# Altium schematic sheet MCU.SchDoc
size A1; Revision: C.2(PCB.SCH)
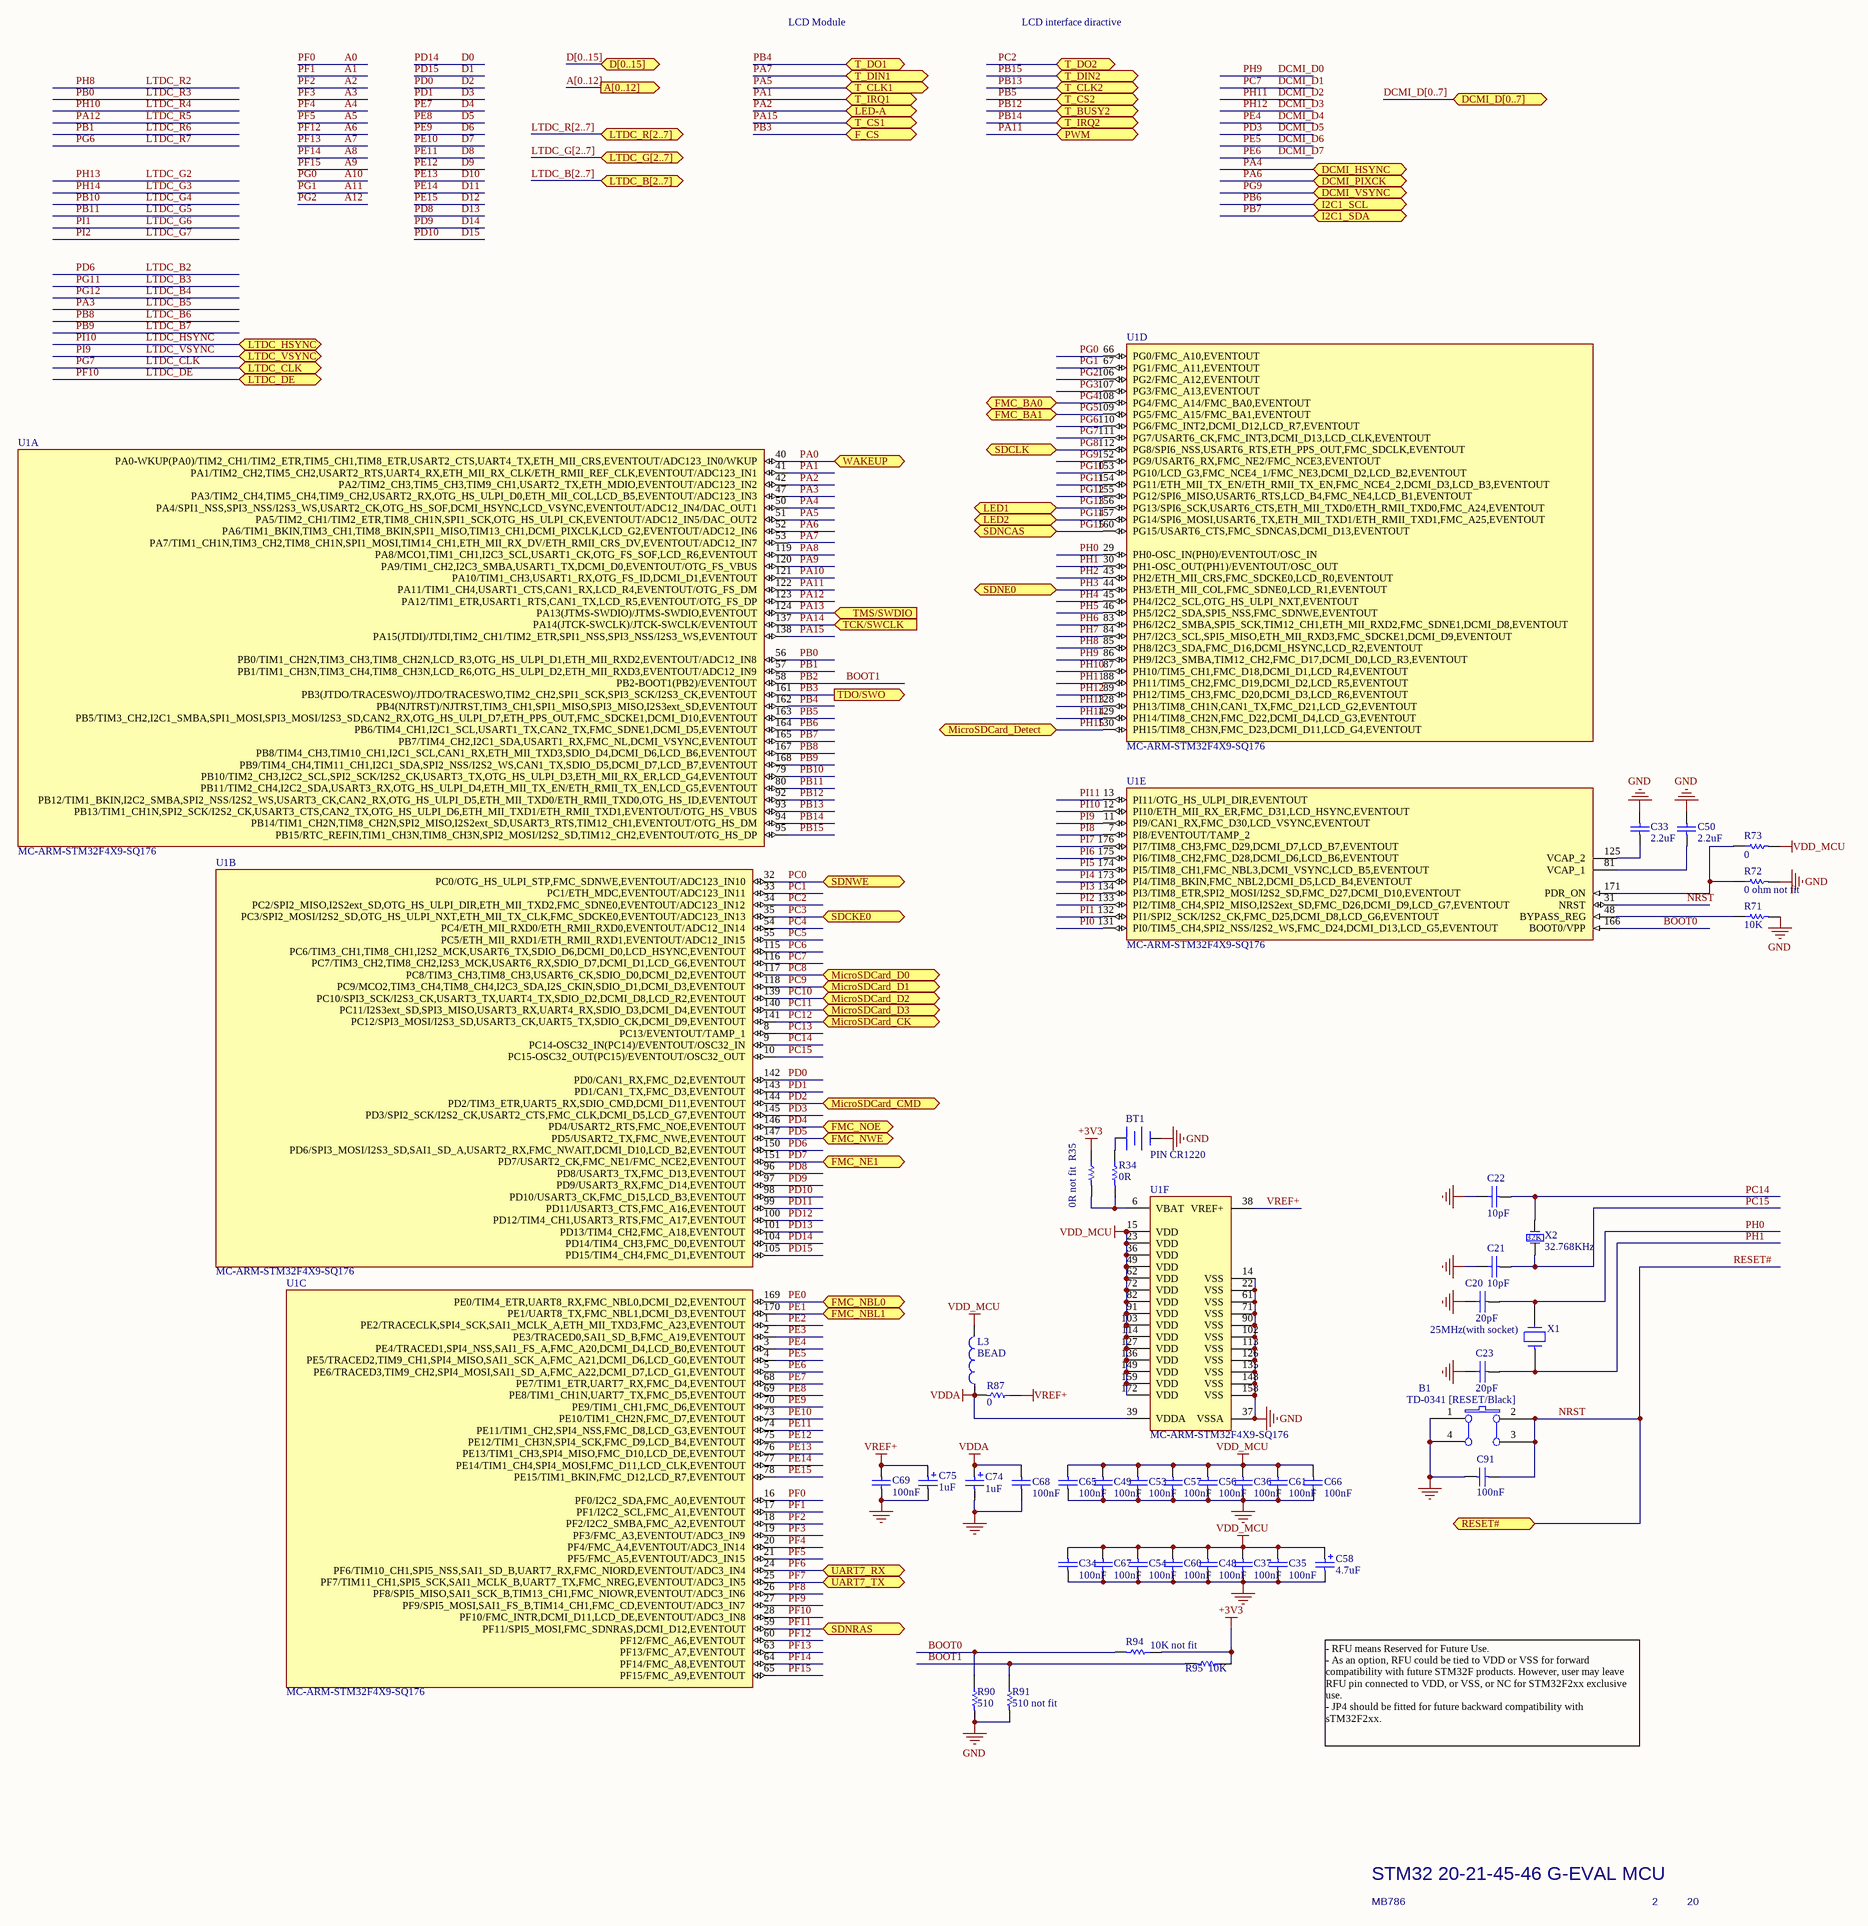
[diagram p0: MCU.SchDoc]

## Parts
B1  TD-0341 [RESET/Black]  [PB]
BT1  PIN CR1220  [PCBComponent_1]
C20  20pF  [0603_C]
C21  10pF  [0603_C]
C22  10pF  [0603_C]
C23  20pF  [0603_C]
C33  2.2uF  [CAPC3216X100N]
C34  100nF  [0603_C]
C35  100nF  [0603_C]
C36  100nF  [0603_C]
C37  100nF  [0603_C]
C48  100nF  [0603_C]
C49  100nF  [0603_C]
C50  2.2uF  [CAPC3216X100N]
C53  100nF  [0603_C]
C54  100nF  [0603_C]
C56  100nF  [0603_C]
C57  100nF  [0603_C]
C58  4.7uF  [AVX-CAPC3528_V]
C60  100nF  [0603_C]
C61  100nF  [0603_C]
C65  100nF  [0603_C]
C66  100nF  [0603_C]
C67  100nF  [0603_C]
C68  100nF  [0603_C]
C69  100nF  [0603_C]
C74  1uF  [AVX-CAPC3528_V]
C75  1uF  [AVX-CAPC3528_V]
C91  100nF  [0603_C]
L3  BEAD  [INDC2012X105N]
R34  0R  [0603_R]
R35  0R not fit  [0603_R]
R71  10K  [0603_R]
R72  0 ohm not fit  [0603_R]
R73  0  [0603_R]
R87  0  [0603_R]
R90  510  [0603_R]
R91  510 not fit  [0603_R]
R94  10K not fit  [0603_R]
R95  10K  [0603_R]
U1  MC-ARM-STM32F4X9-SQ176  [STM-LQFP176_N]  (parts A,B,C,D,E,F of 6)
X1  25MHz(with socket)  [HC49/US-SMD]
X2  32.768KHz  [Cylindrical crystal]

## Ports
A[0..12] (out), D[0..15] (bidir), DCMI_D[0..7], DCMI_HSYNC, DCMI_PIXCK, DCMI_VSYNC, F_CS, FMC_BA0, FMC_BA1, FMC_NBL0, FMC_NBL1, FMC_NE1, FMC_NOE, FMC_NWE, I2C1_SCL, I2C1_SDA, LED1, LED2, LED-A, LTDC_B[2..7] (bidir), LTDC_CLK, LTDC_DE, LTDC_G[2..7] (bidir), LTDC_HSYNC, LTDC_R[2..7] (bidir), LTDC_VSYNC, MicroSDCard_CK (bidir), MicroSDCard_CMD (bidir), MicroSDCard_D0 (bidir), MicroSDCard_D1 (bidir), MicroSDCard_D2 (bidir), MicroSDCard_D3 (bidir), MicroSDCard_Detect, PWM, RESET# (bidir), SDCKE0, SDCLK, SDNCAS, SDNE0, SDNRAS, SDNWE, T_BUSY2, T_CLK1, T_CLK2, T_CS1, T_CS2, T_DIN1, T_DIN2, T_DO1, T_DO2, T_IRQ1, T_IRQ2, TCK/SWCLK (in), TDO/SWO (out), TMS/SWDIO (in), UART7_RX, UART7_TX, WAKEUP

## Nets
+3V3: R35.1 R94.1 R95.1
GND: B1.1(A0) B1.4(A1) BT1.2(-) C20.2 C21.2 C22.2 C23.2 C33.2 C34.2 C35.2 C36.2 C37.2 C48.2 C49.2 C50.2 C53.2 C54.2 C56.2 C57.2 C58.2 C60.2 C61.2 C65.2 C66.2 C67.2 C68.2 C69.2 C74.2 C75.2 C91.1 R71.2 R72.2 R90.2 R91.2 U1.14(VSS) U1.22(VSS) U1.37(VSSA) U1.61(VSS) U1.71(VSS) U1.90(VSS) U1.102(VSS) U1.113(VSS) U1.126(VSS) U1.135(VSS) U1.148(VSS) U1.158(VSS) X2.0
VDD_MCU: C34.1 C35.1 C36.1 C37.1 C48.1 C49.1 C53.1 C54.1 C56.1 C57.1 C58.1 C60.1 C61.1 C65.1 C66.1 C67.1 L3.2 R73.2 U1.15(VDD) U1.23(VDD) U1.36(VDD) U1.49(VDD) U1.62(VDD) U1.72(VDD) U1.82(VDD) U1.91(VDD) U1.103(VDD) U1.114(VDD) U1.127(VDD) U1.136(VDD) U1.149(VDD) U1.159(VDD) U1.172(VDD)
VDDA: C68.1 C74.1 L3.1 R87.2 U1.39(VDDA)
VREF+: C69.1 C75.1 R87.1 U1.38(VREF+)
A0: U1.16(PF0/I2C2_SDA,FMC_A0,EVENTOUT)  [also labelled PF0]
A1: U1.17(PF1/I2C2_SCL,FMC_A1,EVENTOUT)  [also labelled PF1]
A2: U1.18(PF2/I2C2_SMBA,FMC_A2,EVENTOUT)  [also labelled PF2]
A3: U1.19(PF3/FMC_A3,EVENTOUT/ADC3_IN9)  [also labelled PF3]
A4: U1.20(PF4/FMC_A4,EVENTOUT/ADC3_IN14)  [also labelled PF4]
A5: U1.21(PF5/FMC_A5,EVENTOUT/ADC3_IN15)  [also labelled PF5]
A6: U1.60(PF12/FMC_A6,EVENTOUT)  [also labelled PF12]
A7: U1.63(PF13/FMC_A7,EVENTOUT)  [also labelled PF13]
A8: U1.64(PF14/FMC_A8,EVENTOUT)  [also labelled PF14]
A9: U1.65(PF15/FMC_A9,EVENTOUT)  [also labelled PF15]
A10: U1.66(PG0/FMC_A10,EVENTOUT)  [also labelled PG0]
A11: U1.67(PG1/FMC_A11,EVENTOUT)  [also labelled PG1]
A12: U1.106(PG2/FMC_A12,EVENTOUT)  [also labelled PG2]
BOOT0: R90.1 R94.2 U1.166(BOOT0/VPP)
BOOT1: R91.1 R95.2 U1.58(PB2-BOOT1(PB2)/EVENTOUT)  [also labelled PB2]
D0: U1.104(PD14/TIM4_CH3,FMC_D0,EVENTOUT)  [also labelled PD14]
D1: U1.105(PD15/TIM4_CH4,FMC_D1,EVENTOUT)  [also labelled PD15]
D2: U1.142(PD0/CAN1_RX,FMC_D2,EVENTOUT)  [also labelled PD0]
D3: U1.143(PD1/CAN1_TX,FMC_D3,EVENTOUT)  [also labelled PD1]
D4: U1.68(PE7/TIM1_ETR,UART7_RX,FMC_D4,EVENTOUT)  [also labelled PE7]
D5: U1.69(PE8/TIM1_CH1N,UART7_TX,FMC_D5,EVENTOUT)  [also labelled PE8]
D6: U1.70(PE9/TIM1_CH1,FMC_D6,EVENTOUT)  [also labelled PE9]
D7: U1.73(PE10/TIM1_CH2N,FMC_D7,EVENTOUT)  [also labelled PE10]
D8: U1.74(PE11/TIM1_CH2,SPI4_NSS,FMC_D8,LCD_G3,EVENTOUT)  [also labelled PE11]
D9: U1.75(PE12/TIM1_CH3N,SPI4_SCK,FMC_D9,LCD_B4,EVENTOUT)  [also labelled PE12]
D10: U1.76(PE13/TIM1_CH3,SPI4_MISO,FMC_D10,LCD_DE,EVENTOUT)  [also labelled PE13]
D11: U1.77(PE14/TIM1_CH4,SPI4_MOSI,FMC_D11,LCD_CLK,EVENTOUT)  [also labelled PE14]
D12: U1.78(PE15/TIM1_BKIN,FMC_D12,LCD_R7,EVENTOUT)  [also labelled PE15]
D13: U1.96(PD8/USART3_TX,FMC_D13,EVENTOUT)  [also labelled PD8]
D14: U1.97(PD9/USART3_RX,FMC_D14,EVENTOUT)  [also labelled PD9]
D15: U1.98(PD10/USART3_CK,FMC_D15,LCD_B3,EVENTOUT)  [also labelled PD10]
DCMI_D0: U1.86(PH9/I2C3_SMBA,TIM12_CH2,FMC_D17,DCMI_D0,LCD_R3,EVENTOUT)  [also labelled PH9]
DCMI_D1: U1.116(PC7/TIM3_CH2,TIM8_CH2,I2S3_MCK,USART6_RX,SDIO_D7,DCMI_D1,LCD_G6,EVENTOUT)  [also labelled PC7]
DCMI_D2: U1.88(PH11/TIM5_CH2,FMC_D19,DCMI_D2,LCD_R5,EVENTOUT)  [also labelled PH11]
DCMI_D3: U1.89(PH12/TIM5_CH3,FMC_D20,DCMI_D3,LCD_R6,EVENTOUT)  [also labelled PH12]
DCMI_D4: U1.3(PE4/TRACED1,SPI4_NSS,SAI1_FS_A,FMC_A20,DCMI_D4,LCD_B0,EVENTOUT)  [also labelled PE4]
DCMI_D5: U1.145(PD3/SPI2_SCK/I2S2_CK,USART2_CTS,FMC_CLK,DCMI_D5,LCD_G7,EVENTOUT)  [also labelled PD3]
DCMI_D6: U1.4(PE5/TRACED2,TIM9_CH1,SPI4_MISO,SAI1_SCK_A,FMC_A21,DCMI_D6,LCD_G0,EVENTOUT)  [also labelled PE5]
DCMI_D7: U1.5(PE6/TRACED3,TIM9_CH2,SPI4_MOSI,SAI1_SD_A,FMC_A22,DCMI_D7,LCD_G1,EVENTOUT)  [also labelled PE6]
LTDC_B2: U1.150(PD6/SPI3_MOSI/I2S3_SD,SAI1_SD_A,USART2_RX,FMC_NWAIT,DCMI_D10,LCD_B2,EVENTOUT)  [also labelled PD6]
LTDC_B3: U1.154(PG11/ETH_MII_TX_EN/ETH_RMII_TX_EN,FMC_NCE4_2,DCMI_D3,LCD_B3,EVENTOUT)  [also labelled PG11]
LTDC_B4: U1.155(PG12/SPI6_MISO,USART6_RTS,LCD_B4,FMC_NE4,LCD_B1,EVENTOUT)  [also labelled PG12]
LTDC_B5: U1.47(PA3/TIM2_CH4,TIM5_CH4,TIM9_CH2,USART2_RX,OTG_HS_ULPI_D0,ETH_MII_COL,LCD_B5,EVENTOUT/ADC123_IN3)  [also labelled PA3]
LTDC_B6: U1.167(PB8/TIM4_CH3,TIM10_CH1,I2C1_SCL,CAN1_RX,ETH_MII_TXD3,SDIO_D4,DCMI_D6,LCD_B6,EVENTOUT)  [also labelled PB8]
LTDC_B7: U1.168(PB9/TIM4_CH4,TIM11_CH1,I2C1_SDA,SPI2_NSS/I2S2_WS,CAN1_TX,SDIO_D5,DCMI_D7,LCD_B7,EVENTOUT)  [also labelled PB9]
LTDC_CLK: U1.111(PG7/USART6_CK,FMC_INT3,DCMI_D13,LCD_CLK,EVENTOUT) ; port LTDC_CLK  [also labelled PG7]
LTDC_DE: U1.28(PF10/FMC_INTR,DCMI_D11,LCD_DE,EVENTOUT/ADC3_IN8) ; port LTDC_DE  [also labelled PF10]
LTDC_G2: U1.128(PH13/TIM8_CH1N,CAN1_TX,FMC_D21,LCD_G2,EVENTOUT)  [also labelled PH13]
LTDC_G3: U1.129(PH14/TIM8_CH2N,FMC_D22,DCMI_D4,LCD_G3,EVENTOUT)  [also labelled PH14]
LTDC_G4: U1.79(PB10/TIM2_CH3,I2C2_SCL,SPI2_SCK/I2S2_CK,USART3_TX,OTG_HS_ULPI_D3,ETH_MII_RX_ER,LCD_G4,EVENTOUT)  [also labelled PB10]
LTDC_G5: U1.80(PB11/TIM2_CH4,I2C2_SDA,USART3_RX,OTG_HS_ULPI_D4,ETH_MII_TX_EN/ETH_RMII_TX_EN,LCD_G5,EVENTOUT)  [also labelled PB11]
LTDC_G6: U1.132(PI1/SPI2_SCK/I2S2_CK,FMC_D25,DCMI_D8,LCD_G6,EVENTOUT)  [also labelled PI1]
LTDC_G7: U1.133(PI2/TIM8_CH4,SPI2_MISO,I2S2ext_SD,FMC_D26,DCMI_D9,LCD_G7,EVENTOUT)  [also labelled PI2]
LTDC_HSYNC: U1.12(PI10/ETH_MII_RX_ER,FMC_D31,LCD_HSYNC,EVENTOUT) ; port LTDC_HSYNC  [also labelled PI10]
LTDC_R2: U1.85(PH8/I2C3_SDA,FMC_D16,DCMI_HSYNC,LCD_R2,EVENTOUT)  [also labelled PH8]
LTDC_R3: U1.56(PB0/TIM1_CH2N,TIM3_CH3,TIM8_CH2N,LCD_R3,OTG_HS_ULPI_D1,ETH_MII_RXD2,EVENTOUT/ADC12_IN8)  [also labelled PB0]
LTDC_R4: U1.87(PH10/TIM5_CH1,FMC_D18,DCMI_D1,LCD_R4,EVENTOUT)  [also labelled PH10]
LTDC_R5: U1.123(PA12/TIM1_ETR,USART1_RTS,CAN1_TX,LCD_R5,EVENTOUT/OTG_FS_DP)  [also labelled PA12]
LTDC_R6: U1.57(PB1/TIM1_CH3N,TIM3_CH4,TIM8_CH3N,LCD_R6,OTG_HS_ULPI_D2,ETH_MII_RXD3,EVENTOUT/ADC12_IN9)  [also labelled PB1]
LTDC_R7: U1.110(PG6/FMC_INT2,DCMI_D12,LCD_R7,EVENTOUT)  [also labelled PG6]
LTDC_VSYNC: U1.11(PI9/CAN1_RX,FMC_D30,LCD_VSYNC,EVENTOUT) ; port LTDC_VSYNC  [also labelled PI9]
NRST: B1.2(B0) B1.3(B1) C91.2 U1.31(NRST) ; port RESET#  [also labelled RESET#]
PA0: U1.40(PA0-WKUP(PA0)/TIM2_CH1/TIM2_ETR,TIM5_CH1,TIM8_ETR,USART2_CTS,UART4_TX,ETH_MII_CRS,EVENTOUT/ADC123_IN0/WKUP) ; port WAKEUP
PA1: U1.41(PA1/TIM2_CH2,TIM5_CH2,USART2_RTS,UART4_RX,ETH_MII_RX_CLK/ETH_RMII_REF_CLK,EVENTOUT/ADC123_IN1) ; port T_IRQ1
PA2: U1.42(PA2/TIM2_CH3,TIM5_CH3,TIM9_CH1,USART2_TX,ETH_MDIO,EVENTOUT/ADC123_IN2) ; port LED-A
PA4: U1.50(PA4/SPI1_NSS,SPI3_NSS/I2S3_WS,USART2_CK,OTG_HS_SOF,DCMI_HSYNC,LCD_VSYNC,EVENTOUT/ADC12_IN4/DAC_OUT1) ; port DCMI_HSYNC
PA5: U1.51(PA5/TIM2_CH1/TIM2_ETR,TIM8_CH1N,SPI1_SCK,OTG_HS_ULPI_CK,EVENTOUT/ADC12_IN5/DAC_OUT2) ; port T_CLK1
PA6: U1.52(PA6/TIM1_BKIN,TIM3_CH1,TIM8_BKIN,SPI1_MISO,TIM13_CH1,DCMI_PIXCLK,LCD_G2,EVENTOUT/ADC12_IN6) ; port DCMI_PIXCK
PA7: U1.53(PA7/TIM1_CH1N,TIM3_CH2,TIM8_CH1N,SPI1_MOSI,TIM14_CH1,ETH_MII_RX_DV/ETH_RMII_CRS_DV,EVENTOUT/ADC12_IN7) ; port T_DIN1
PA8: U1.119(PA8/MCO1,TIM1_CH1,I2C3_SCL,USART1_CK,OTG_FS_SOF,LCD_R6,EVENTOUT)
PA9: U1.120(PA9/TIM1_CH2,I2C3_SMBA,USART1_TX,DCMI_D0,EVENTOUT/OTG_FS_VBUS)
PA10: U1.121(PA10/TIM1_CH3,USART1_RX,OTG_FS_ID,DCMI_D1,EVENTOUT)
PA11: U1.122(PA11/TIM1_CH4,USART1_CTS,CAN1_RX,LCD_R4,EVENTOUT/OTG_FS_DM) ; port PWM
PA13: U1.124(PA13(JTMS-SWDIO)/JTMS-SWDIO,EVENTOUT) ; port TMS/SWDIO
PA14: U1.137(PA14(JTCK-SWCLK)/JTCK-SWCLK/EVENTOUT) ; port TCK/SWCLK
PA15: U1.138(PA15(JTDI)/JTDI,TIM2_CH1/TIM2_ETR,SPI1_NSS,SPI3_NSS/I2S3_WS,EVENTOUT) ; port T_CS1
PB3: U1.161(PB3(JTDO/TRACESWO)/JTDO/TRACESWO,TIM2_CH2,SPI1_SCK,SPI3_SCK/I2S3_CK,EVENTOUT) ; port TDO/SWO, port F_CS
PB4: U1.162(PB4(NJTRST)/NJTRST,TIM3_CH1,SPI1_MISO,SPI3_MISO,I2S3ext_SD,EVENTOUT) ; port T_DO1
PB5: U1.163(PB5/TIM3_CH2,I2C1_SMBA,SPI1_MOSI,SPI3_MOSI/I2S3_SD,CAN2_RX,OTG_HS_ULPI_D7,ETH_PPS_OUT,FMC_SDCKE1,DCMI_D10,EVENTOUT) ; port T_CS2
PB6: U1.164(PB6/TIM4_CH1,I2C1_SCL,USART1_TX,CAN2_TX,FMC_SDNE1,DCMI_D5,EVENTOUT) ; port I2C1_SCL
PB7: U1.165(PB7/TIM4_CH2,I2C1_SDA,USART1_RX,FMC_NL,DCMI_VSYNC,EVENTOUT) ; port I2C1_SDA
PB12: U1.92(PB12/TIM1_BKIN,I2C2_SMBA,SPI2_NSS/I2S2_WS,USART3_CK,CAN2_RX,OTG_HS_ULPI_D5,ETH_MII_TXD0/ETH_RMII_TXD0,OTG_HS_ID,EVENTOUT) ; port T_BUSY2
PB13: U1.93(PB13/TIM1_CH1N,SPI2_SCK/I2S2_CK,USART3_CTS,CAN2_TX,OTG_HS_ULPI_D6,ETH_MII_TXD1/ETH_RMII_TXD1,EVENTOUT/OTG_HS_VBUS) ; port T_CLK2
PB14: U1.94(PB14/TIM1_CH2N,TIM8_CH2N,SPI2_MISO,I2S2ext_SD,USART3_RTS,TIM12_CH1,EVENTOUT/OTG_HS_DM) ; port T_IRQ2
PB15: U1.95(PB15/RTC_REFIN,TIM1_CH3N,TIM8_CH3N,SPI2_MOSI/I2S2_SD,TIM12_CH2,EVENTOUT/OTG_HS_DP) ; port T_DIN2
PC0: U1.32(PC0/OTG_HS_ULPI_STP,FMC_SDNWE,EVENTOUT/ADC123_IN10) ; port SDNWE
PC1: U1.33(PC1/ETH_MDC,EVENTOUT/ADC123_IN11)
PC2: U1.34(PC2/SPI2_MISO,I2S2ext_SD,OTG_HS_ULPI_DIR,ETH_MII_TXD2,FMC_SDNE0,EVENTOUT/ADC123_IN12) ; port T_DO2
PC3: U1.35(PC3/SPI2_MOSI/I2S2_SD,OTG_HS_ULPI_NXT,ETH_MII_TX_CLK,FMC_SDCKE0,EVENTOUT/ADC123_IN13) ; port SDCKE0
PC4: U1.54(PC4/ETH_MII_RXD0/ETH_RMII_RXD0,EVENTOUT/ADC12_IN14)
PC5: U1.55(PC5/ETH_MII_RXD1/ETH_RMII_RXD1,EVENTOUT/ADC12_IN15)
PC6: U1.115(PC6/TIM3_CH1,TIM8_CH1,I2S2_MCK,USART6_TX,SDIO_D6,DCMI_D0,LCD_HSYNC,EVENTOUT)
PC8: U1.117(PC8/TIM3_CH3,TIM8_CH3,USART6_CK,SDIO_D0,DCMI_D2,EVENTOUT) ; port MicroSDCard_D0
PC9: U1.118(PC9/MCO2,TIM3_CH4,TIM8_CH4,I2C3_SDA,I2S_CKIN,SDIO_D1,DCMI_D3,EVENTOUT) ; port MicroSDCard_D1
PC10: U1.139(PC10/SPI3_SCK/I2S3_CK,USART3_TX,UART4_TX,SDIO_D2,DCMI_D8,LCD_R2,EVENTOUT) ; port MicroSDCard_D2
PC11: U1.140(PC11/I2S3ext_SD,SPI3_MISO,USART3_RX,UART4_RX,SDIO_D3,DCMI_D4,EVENTOUT) ; port MicroSDCard_D3
PC12: U1.141(PC12/SPI3_MOSI/I2S3_SD,USART3_CK,UART5_TX,SDIO_CK,DCMI_D9,EVENTOUT) ; port MicroSDCard_CK
PC13: U1.8(PC13/EVENTOUT/TAMP_1)
PC14: C22.1 U1.9(PC14-OSC32_IN(PC14)/EVENTOUT/OSC32_IN) X2.1(OSC1)
PC15: C21.1 U1.10(PC15-OSC32_OUT(PC15)/EVENTOUT/OSC32_OUT) X2.2(OSC2)
PD2: U1.144(PD2/TIM3_ETR,UART5_RX,SDIO_CMD,DCMI_D11,EVENTOUT) ; port MicroSDCard_CMD
PD4: U1.146(PD4/USART2_RTS,FMC_NOE,EVENTOUT) ; port FMC_NOE
PD5: U1.147(PD5/USART2_TX,FMC_NWE,EVENTOUT) ; port FMC_NWE
PD7: U1.151(PD7/USART2_CK,FMC_NE1/FMC_NCE2,EVENTOUT) ; port FMC_NE1
PD11: U1.99(PD11/USART3_CTS,FMC_A16,EVENTOUT)
PD12: U1.100(PD12/TIM4_CH1,USART3_RTS,FMC_A17,EVENTOUT)
PD13: U1.101(PD13/TIM4_CH2,FMC_A18,EVENTOUT)
PE0: U1.169(PE0/TIM4_ETR,UART8_RX,FMC_NBL0,DCMI_D2,EVENTOUT) ; port FMC_NBL0
PE1: U1.170(PE1/UART8_TX,FMC_NBL1,DCMI_D3,EVENTOUT) ; port FMC_NBL1
PE2: U1.1(PE2/TRACECLK,SPI4_SCK,SAI1_MCLK_A,ETH_MII_TXD3,FMC_A23,EVENTOUT)
PE3: U1.2(PE3/TRACED0,SAI1_SD_B,FMC_A19,EVENTOUT)
PF6: U1.24(PF6/TIM10_CH1,SPI5_NSS,SAI1_SD_B,UART7_RX,FMC_NIORD,EVENTOUT/ADC3_IN4) ; port UART7_RX
PF7: U1.25(PF7/TIM11_CH1,SPI5_SCK,SAI1_MCLK_B,UART7_TX,FMC_NREG,EVENTOUT/ADC3_IN5) ; port UART7_TX
PF8: U1.26(PF8/SPI5_MISO,SAI1_SCK_B,TIM13_CH1,FMC_NIOWR,EVENTOUT/ADC3_IN6)
PF9: U1.27(PF9/SPI5_MOSI,SAI1_FS_B,TIM14_CH1,FMC_CD,EVENTOUT/ADC3_IN7)
PF11: U1.59(PF11/SPI5_MOSI,FMC_SDNRAS,DCMI_D12,EVENTOUT) ; port SDNRAS
PG3: U1.107(PG3/FMC_A13,EVENTOUT)
PG4: U1.108(PG4/FMC_A14/FMC_BA0,EVENTOUT) ; port FMC_BA0
PG5: U1.109(PG5/FMC_A15/FMC_BA1,EVENTOUT) ; port FMC_BA1
PG8: U1.112(PG8/SPI6_NSS,USART6_RTS,ETH_PPS_OUT,FMC_SDCLK,EVENTOUT) ; port SDCLK
PG9: U1.152(PG9/USART6_RX,FMC_NE2/FMC_NCE3,EVENTOUT) ; port DCMI_VSYNC
PG10: U1.153(PG10/LCD_G3,FMC_NCE4_1/FMC_NE3,DCMI_D2,LCD_B2,EVENTOUT)
PG13: U1.156(PG13/SPI6_SCK,USART6_CTS,ETH_MII_TXD0/ETH_RMII_TXD0,FMC_A24,EVENTOUT) ; port LED1
PG14: U1.157(PG14/SPI6_MOSI,USART6_TX,ETH_MII_TXD1/ETH_RMII_TXD1,FMC_A25,EVENTOUT) ; port LED2
PG15: U1.160(PG15/USART6_CTS,FMC_SDNCAS,DCMI_D13,EVENTOUT) ; port SDNCAS
PH0: C20.1 U1.29(PH0-OSC_IN(PH0)/EVENTOUT/OSC_IN) X1.2
PH1: C23.1 U1.30(PH1-OSC_OUT(PH1)/EVENTOUT/OSC_OUT) X1.1
PH2: U1.43(PH2/ETH_MII_CRS,FMC_SDCKE0,LCD_R0,EVENTOUT)
PH3: U1.44(PH3/ETH_MII_COL,FMC_SDNE0,LCD_R1,EVENTOUT) ; port SDNE0
PH4: U1.45(PH4/I2C2_SCL,OTG_HS_ULPI_NXT,EVENTOUT)
PH5: U1.46(PH5/I2C2_SDA,SPI5_NSS,FMC_SDNWE,EVENTOUT)
PH6: U1.83(PH6/I2C2_SMBA,SPI5_SCK,TIM12_CH1,ETH_MII_RXD2,FMC_SDNE1,DCMI_D8,EVENTOUT)
PH7: U1.84(PH7/I2C3_SCL,SPI5_MISO,ETH_MII_RXD3,FMC_SDCKE1,DCMI_D9,EVENTOUT)
PH15: U1.130(PH15/TIM8_CH3N,FMC_D23,DCMI_D11,LCD_G4,EVENTOUT) ; port MicroSDCard_Detect
PI0: U1.131(PI0/TIM5_CH4,SPI2_NSS/I2S2_WS,FMC_D24,DCMI_D13,LCD_G5,EVENTOUT)
PI3: U1.134(PI3/TIM8_ETR,SPI2_MOSI/I2S2_SD,FMC_D27,DCMI_D10,EVENTOUT)
PI4: U1.173(PI4/TIM8_BKIN,FMC_NBL2,DCMI_D5,LCD_B4,EVENTOUT)
PI5: U1.174(PI5/TIM8_CH1,FMC_NBL3,DCMI_VSYNC,LCD_B5,EVENTOUT)
PI6: U1.175(PI6/TIM8_CH2,FMC_D28,DCMI_D6,LCD_B6,EVENTOUT)
PI7: U1.176(PI7/TIM8_CH3,FMC_D29,DCMI_D7,LCD_B7,EVENTOUT)
PI8: U1.7(PI8/EVENTOUT/TAMP_2)
PI11: U1.13(PI11/OTG_HS_ULPI_DIR,EVENTOUT)
NetBT1_1: BT1.1(+) R34.1
NetC33_1: C33.1 U1.125(VCAP_2)
NetC50_1: C50.1 U1.81(VCAP_1)
NetR34_2: R34.2 R35.2 U1.6(VBAT)
NetR71_1: R71.1 U1.48(BYPASS_REG)
NetR72_1: R72.1 R73.1 U1.171(PDR_ON)

## Buses and harness runs
bus A[0..12] = port A[0..12]
bus D[0..15] = port D[0..15]
bus DCMI_D[0..7] = port DCMI_D[0..7]
bus LTDC_B[2..7] = port LTDC_B[2..7]
bus LTDC_G[2..7] = port LTDC_G[2..7]
bus LTDC_R[2..7] = port LTDC_R[2..7]

## Notes on the sheet
- LCD Module
- LCD interface diractive
- - RFU means Reserved for Future Use.
  - As an option, RFU could be tied to VDD or VSS for forward compatibility with future STM32F products. However, user may leave RFU pin connected to VDD, or VSS, or NC for STM32F2xx exclusive use.
  - JP4 should be fitted for future backward compatibility with sTM32F2xx.
- STM32 20-21-45-46 G-EVAL MCU
- MB786
- 2
- 20
- STMicroelectronics
- Title:
- Number:
- Rev:
- Date:
- Sheet       of
- (in symbol XTAL/32KHz) 32K

## Library data of the parts
B1 = SW PUSHBUTTON: SE PUSHBUTTON
BT1 = Battery3.3V: Multicell Battery; Published: 24-Mar-1999; LatestRevisionDate: 17-Jul-2002; LatestRevisionNote: Re-released for DXP Platform.; PackageReference: BAT-2; Publisher: Altium Limited
C20-C23 = CAP: Capacitor
C33-C37 C48-C50 C53 C54 C56 C57 C60 C61 C65-C69 = Cap: Capacitor; Value: 10nF; Published: 8-Jun-2000; Revision: July-2002: Re-released for DXP Platform.; Publisher: Altium Limited
C58 = Cap Pol1: Polarized Capacitor (Radial); Value: 47uF; Published: 8-Jun-2000; Revision: July-2002: Re-released for DXP Platform.; Publisher: Altium Limited
C74 C75 = Cap Pol1: Polarized Capacitor (Radial); Value: 10uF; Published: 8-Jun-2000; Revision: July-2002: Re-released for DXP Platform.; Publisher: Altium Limited
C91 = CAP: Capacitor; Value: 100pF; Published: 8-Jun-2000; Revision: July-2002: Re-released for DXP Platform.; Publisher: Altium Limited
L3 = Inductor: Value: 100uH; Published: 8-Jun-2000; Revision: July-2002: Re-released for DXP Platform.; Publisher: Altium Limited
R34 R35 R90 R91 R94 R95 = res1: Resistor; Value: 1K; Published: 8-Jun-2000; Revision: July-2002: Re-released for DXP Platform.; Publisher: Altium Limited
R71 = Res1: Resistor; Published: 8-Jun-2000; Revision: July-2002: Re-released for DXP Platform.; Publisher: Altium Limited; Value: 10K
R72 R73 R87 = Res1: Resistor; Value: 1K; Published: 8-Jun-2000; Revision: July-2002: Re-released for DXP Platform.; Publisher: Altium Limited
X1 = CRYSTAL
X2 = XTAL/32KHz: Crystal Oscillator; Published: 8-Jun-2000; LatestRevisionDate: 17-Jul-2002; LatestRevisionNote: Re-released for DXP Platform.; PackageReference: R38; Publisher: Altium Limited